# EAGLE design eg_for_wind (EAGLE 5.12)
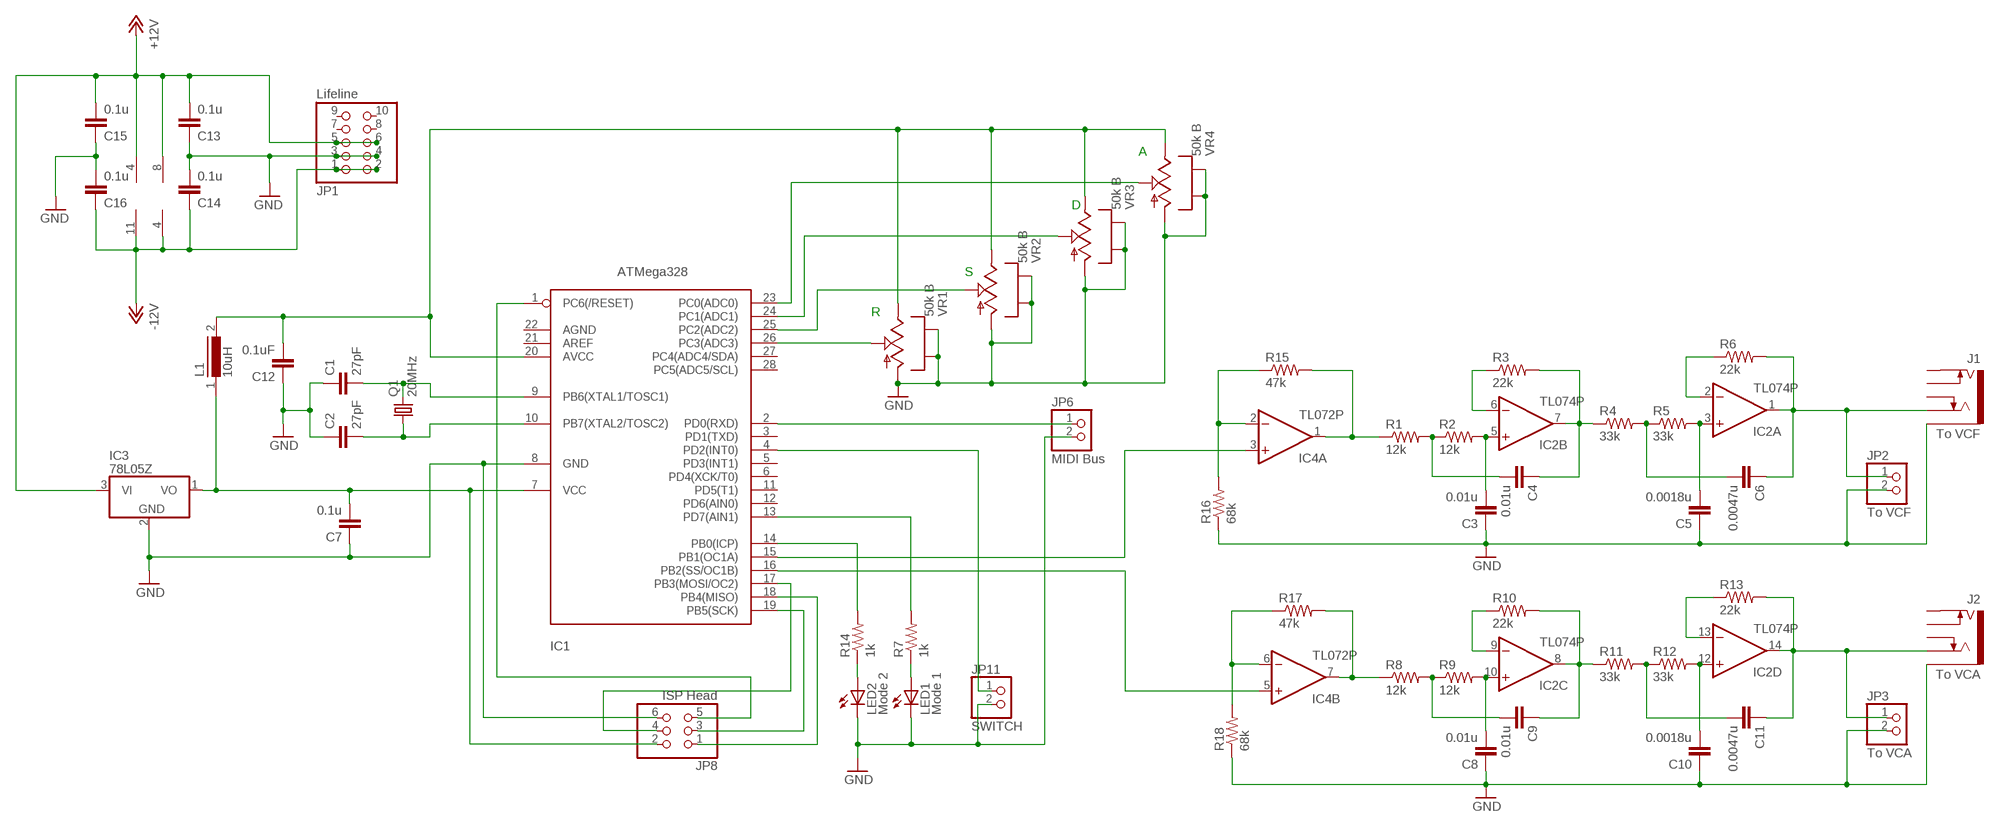
[diagram p0: schematic, sheet 1]

## Parts
C1  27pF  C-EU050-025X075  [C050-025X075]
C2  27pF  C-EU050-025X075  [C050-025X075]
C3  0.01u  C-EU050-025X075  [C050-025X075]
C4  0.01u  C-EU050-025X075  [C050-025X075]
C5  0.0018u  C-EU050-025X075  [C050-025X075]
C6  0.0047u  C-EU050-025X075  [C050-025X075]
C7  0.1u  C-EU050-025X075  [C050-025X075]
C8  0.01u  C-EU050-025X075  [C050-025X075]
C9  0.01u  C-EU050-025X075  [C050-025X075]
C10  0.0018u  C-EU050-025X075  [C050-025X075]
C11  0.0047u  C-EU050-025X075  [C050-025X075]
C12  0.1uF  C-EU050-025X075  [C050-025X075]
C13  0.1u  C-EU050-025X075  [C050-025X075]
C14  0.1u  C-EU050-025X075  [C050-025X075]
C15  0.1u  C-EU050-025X075  [C050-025X075]
C16  0.1u  C-EU050-025X075  [C050-025X075]
IC1  ATMega328  MEGA8-P  [DIL28-3]
IC2  TL074P  [DIL14]
IC3  78L05Z  [TO92]
IC4  TL072P  [DIL08]
J1  To VCF  MJ-352W-C"  [MJ-352-M-C]
J2  To VCA  MJ-352W-C"  [MJ-352-M-C]
JP1  Lifeline  PINHD-2X5  [2X05]
JP2  To VCF  PINHD-1X2  [1X02]
JP3  To VCA  PINHD-1X2  [1X02]
JP6  MIDI Bus  PINHD-1X2  [1X02]
JP8  ISP Head  PINHD-2X3  [2X03]
JP11  SWITCH  PINHD-1X2  [1X02]
L1  10uH  82114R  [82114R]
LED1  Mode 1  LED3MM  [LED3MM]
LED2  Mode 2  LED3MM  [LED3MM]
Q1  20MHz  CRYTALHC49S  [HC49/S]
R1  12k  R-US_0204/5_SF  [0204/5_SF]
R2  12k  R-US_0204/5_SF  [0204/5_SF]
R3  22k  R-US_0204/5_SF  [0204/5_SF]
R4  33k  R-US_0204/5_SF  [0204/5_SF]
R5  33k  R-US_0204/5_SF  [0204/5_SF]
R6  22k  R-US_0204/5_SF  [0204/5_SF]
R7  1k  R-US_0204/5_SF  [0204/5_SF]
R8  12k  R-US_0204/5_SF  [0204/5_SF]
R9  12k  R-US_0204/5_SF  [0204/5_SF]
R10  22k  R-US_0204/5_SF  [0204/5_SF]
R11  33k  R-US_0204/5_SF  [0204/5_SF]
R12  33k  R-US_0204/5_SF  [0204/5_SF]
R13  22k  R-US_0204/5_SF  [0204/5_SF]
R14  1k  R-US_0204/5_SF  [0204/5_SF]
R15  47k  R-US_0204/5_SF  [0204/5_SF]
R16  68k  R-US_0204/5_SF  [0204/5_SF]
R17  47k  R-US_0204/5_SF  [0204/5_SF]
R18  68k  R-US_0204/5_SF  [0204/5_SF]
VR1  50k B  POT-FRAMEE  [EVUE2]
VR2  50k B  POT-FRAMEE  [EVUE2]
VR3  50k B  POT-FRAMEE  [EVUE2]
VR4  50k B  POT-FRAMEE  [EVUE2]

## Nets
+12V: C13.2 C15.2 IC2.4(P:V+) IC3.3(VI) IC4.8(P:V+) JP1.5 JP1.6
-12V: C14.1 C16.1 IC2.11(P:V-) IC4.4(P:V-) JP1.1 JP1.2
GND: C1.1 C2.1 C3.1 C5.1 C7.1 C8.1 C10.1 C12.1 C13.1 C14.2 C15.1 C16.2 IC1.8(GND) IC3.2(GND) J1.P$1 J2.P$1 JP1.3 JP1.4 JP2.2 JP3.2 JP6.2 JP8.6 JP11.2 LED1.K(C) LED2.K(C) R16.1 R18.1 VR1.A VR1.FRAME1(KNOT1) VR1.FRAME2(KNOT2) VR2.A VR2.FRAME1(KNOT1) VR2.FRAME2(KNOT2) VR3.A VR3.FRAME1(KNOT1) VR3.FRAME2(KNOT2) VR4.A VR4.FRAME1(KNOT1) VR4.FRAME2(KNOT2)
N$1: C9.2 R8.2 R9.1
N$2: C4.2 R1.2 R2.1
N$3: C5.2 IC2.3(A:+IN) R5.2
N$4: C3.2 IC2.5(B:+IN) R2.2
N$5: C4.1 IC2.7(B:OUT) R3.2 R4.1
N$6: C6.2 R4.2 R5.1
N$7: C1.2 IC1.9(PB6(XTAL1/TOSC1)) Q1.2
N$8: C2.2 IC1.10(PB7(XTAL2/TOSC2)) Q1.1
N$9: IC1.23(PC0(ADC0)) VR4.S
N$10: IC1.24(PC1(ADC1)) VR3.S
N$11: IC1.25(PC2(ADC2)) VR2.S
N$12: IC1.26(PC3(ADC3)) VR1.S
N$13: LED2.A R14.1
N$14: IC2.6(B:-IN) R3.1
N$15: C10.2 IC2.12(D:+IN) R12.2
N$16: IC2.2(A:-IN) R6.1
N$17: C6.1 IC2.1(A:OUT) J1.P$2 JP2.1 R6.2
N$18: LED1.A R7.1
N$19: IC1.4(PD2(INT0)) JP11.1
N$20: IC1.2(PD0(RXD)) JP6.1
N$21: C8.2 IC2.10(C:+IN) R9.2
N$22: C9.1 IC2.8(C:OUT) R10.2 R11.1
N$23: C11.2 R11.2 R12.1
N$24: IC2.9(C:-IN) R10.1
N$25: IC2.13(D:-IN) R13.1
N$26: C11.1 IC2.14(D:OUT) J2.P$2 JP3.1 R13.2
N$27: IC1.15(PB1(OC1A)) IC4.3(A:+IN)
N$28: IC1.16(PB2(SS/OC1B)) IC4.5(B:+IN)
N$29: IC1.14(PB0(ICP)) R14.2
N$30: IC1.18(PB4(MISO)) JP8.1
N$31: C12.2 IC1.20(AVCC) L1.2 VR1.E VR2.E VR3.E VR4.E
N$32: IC1.19(PB5(SCK)) JP8.3
N$33: IC1.17(PB3(MOSI/OC2)) JP8.4
N$34: IC1.1(PC6(/RESET)) JP8.5
N$35: IC4.1(A:OUT) R1.1 R15.2
N$36: IC1.13(PD7(AIN1)) R7.2
N$38: IC4.7(B:OUT) R8.1 R17.2
N$39: IC4.2(A:-IN) R15.1 R16.2
N$40: IC4.6(B:-IN) R17.1 R18.2
N$41: C7.2 IC1.7(VCC) IC3.1(VO) JP8.2 L1.1
Unconnected: IC1.3(PD1(TXD)) IC1.5(PD3(INT1)) IC1.6(PD4(XCK/T0)) IC1.11(PD5(T1)) IC1.12(PD6(AIN0)) IC1.21(AREF) IC1.22(AGND) IC1.27(PC4(ADC4/SDA)) IC1.28(PC5(ADC5/SCL)) J1.P$3 J1.P$4 J1.P$5 J2.P$3 J2.P$4 J2.P$5 JP1.7 JP1.8 JP1.9 JP1.10

## Notes on the sheet
- A
- D
- S
- R

## Library data of the parts
C1-C16 = akihabara:C-EU: CAPACITOR, European symbol
IC1 = atmel:MEGA8-P: MICROCONTROLLER 8 Kbytes FLASH 1 kbytes SRAM 512 bytes EEPROM USART 4-channel 10 bit ADC 2-channel 8 bit ADC Source: avr.lbr
IC2 = linear:TL074: OP AMP
IC3 = linear:78*: Positive VOLTAGE REGULATOR Source: http://cache.national.com/ds/LM/LM78L05.pdf http://www.fairchildsemi.com/ds/LM/LM7805.pdf
IC4 = linear:TL072: OP AMP
J1 J2 = akihabara:MJ-352W-C: MJ-352W-C Marushin 3.5mm Stereo Jack
JP1 = pinhead:PINHD-2X5: PIN HEADER
JP2 JP3 JP6 JP11 = pinhead:PINHD-1X2: PIN HEADER
JP8 = pinhead:PINHD-2X3: PIN HEADER
L1 = inductors:82114R: INDUCTOR
LED1 LED2 = akihabara:LED: LED OSRAM: - CHIPLED LG R971, LG N971, LY N971, LG Q971, LY Q971, LO R971, LY R971 LH N974, LH R974 LS Q976, LO Q976, LY Q976 LO Q996 - Hyper CHIPLED LW Q18S LB Q993, LB Q99A, LB R99A - SideLED LS A670, LO A670, LY A670, LG A670, LP A670 LB A673, LV A673, LT A673, LW A673 LH A674 LY A675 LS A676, LA A676, LO A676, LY A676, LW A676 LS A679, LY A679, LG A679 - Hyper Micro SIDELED® LS Y876, LA Y876, LO Y876, LY Y876 LT Y87S - SmartLED LW L88C, LW L88S LB L89C, LB L89S, LG L890 LS L89K, LO L89K, LY L89K LS L896, LA L896, LO L896, LY L896 - TOPLED LS T670, LO T670, LY T670, LG T670, LP T670 LSG T670, LSP T670, LSY T670, LOP T670, LYG T670 LG T671, LOG T671, LSG T671 LB T673, LV T673, LT T673, LW T673 LH T674 LS T676, LA T676, LO T676, LY T676, LB T676, LH T676, LSB T676, LW T676 LB T67C, LV T67C, LT T67C, LS T67K, LO T67K, LY T67K, LW E67C LS E67B, LA E67B, LO E67B, LY E67B, LB E67C, LV E67C, LT E67C LW T67C LS T679, LY T679, LG T679 LS T770, LO T770, LY T770, LG T770, LP T770 LB T773, LV T773, LT T773, LW T773 LH T774 LS E675, LA E675, LY E675, LS T675 LS T776, LA T776, LO T776, LY T776, LB T776 LHGB T686 LT T68C, LB T68C - Hyper Mini TOPLED® LB M676 - Mini TOPLED Santana® LG M470 LS M47K, LO M47K, LY M47K Source: http://www.osram.convergy.de/
Q1 = crystal:CRYTAL: CRYSTAL
R1-R18 = akihabara:R-US_: RESISTOR, American symbol
VR1-VR4 = akihabara:POT-FRAME

## Board
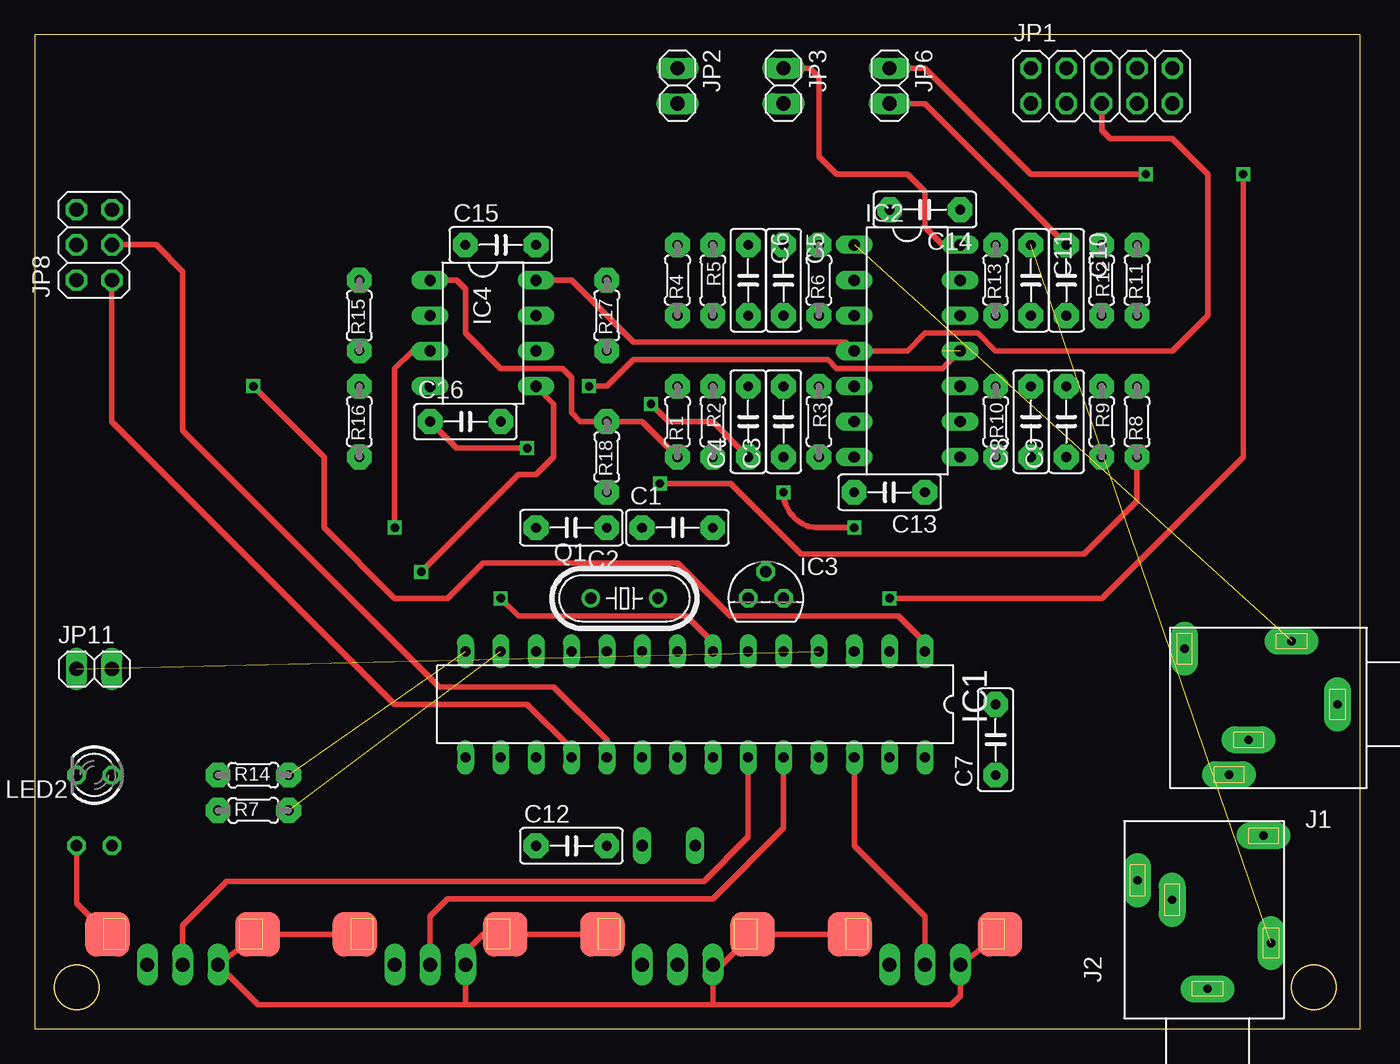
[diagram p1: board, top side]
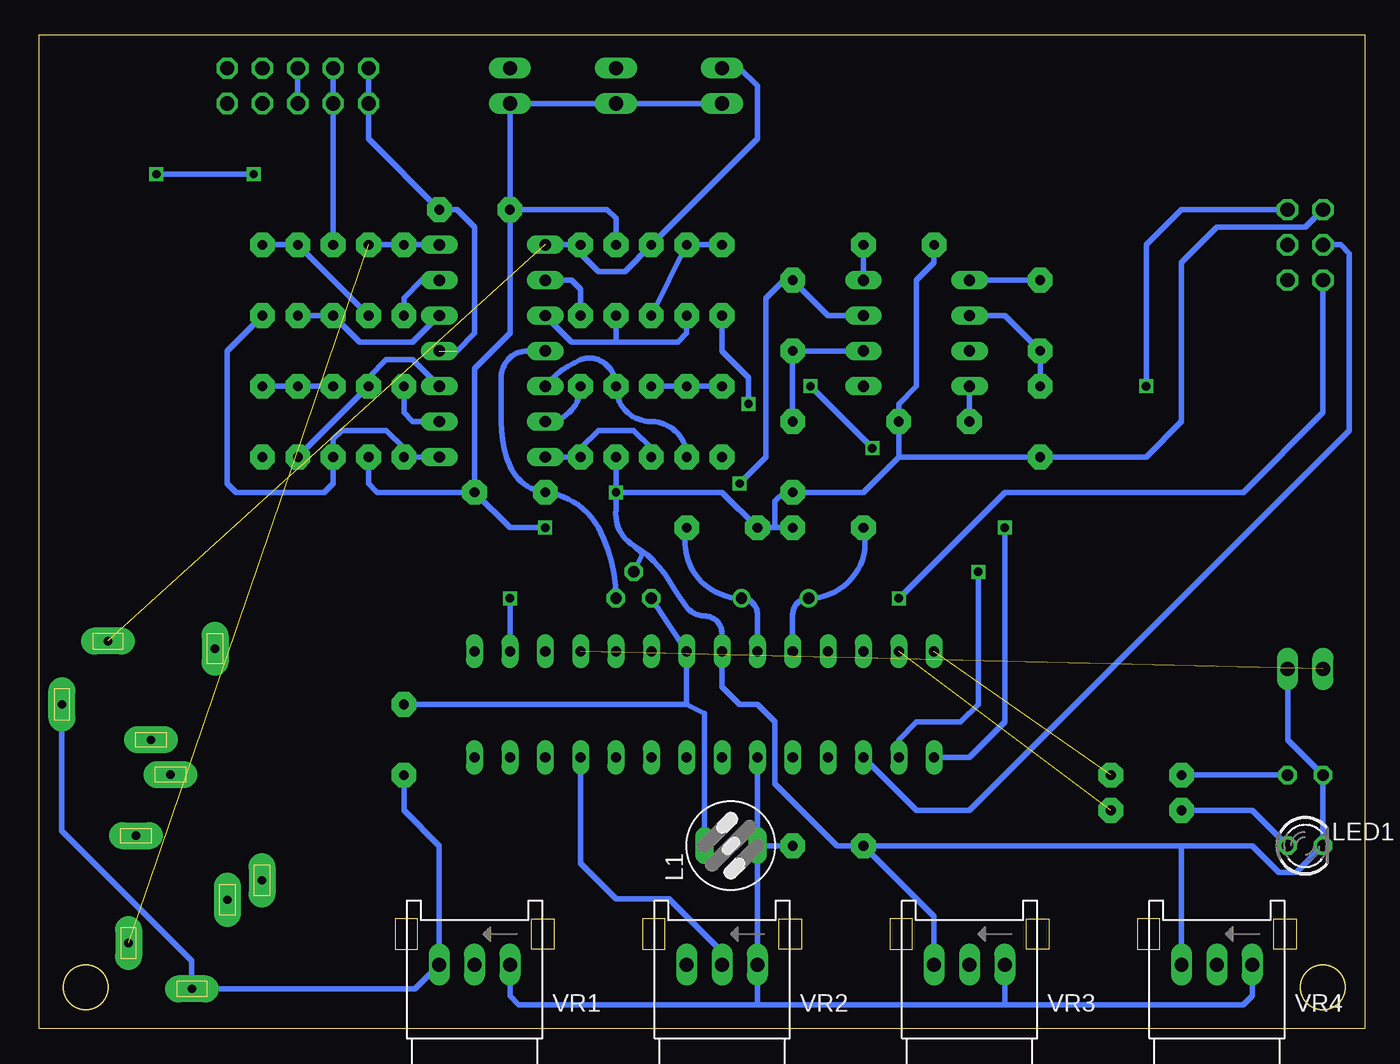
[diagram p2: board, bottom side, seen from below]

Size 95.25 x 71.44 mm. Coordinates in mm from the lower left corner, seen from the top.
Outline: 0,0 95.25,0 95.25,71.44 0,71.44 0,0
Outline: circle at 3,3 radius 1.6
Outline: circle at 91.9,3 radius 1.6
Copper layers (1*16): Top 0.035mm / dielectric 1.5mm / Bottom 0.035mm
Design rules "default": minimum track width 10mil, minimum drill 24mil, track to track 8mil, track to pad 8mil, pad to pad 8mil, via to via 8mil, smd to smd 8mil, copper to edge 40mil, drill to drill 8mil, minimum pad ring 10mil, minimum via ring 8mil, stop-mask expansion 4mil, vias tented up to drill 0mil, thermal gap 10mil

### Footprints (pad centres in the part's own frame; a part is rotated, then mirrored left to right if it is on the bottom)
C050-025X075 = drill 0.7 pad 1.778 octagon: 1 -2.54,0; 2 2.54,0
DIL28-3 = drill 0.726 long: 1 -16.51,-3.81; 2 -13.97,-3.81; 3 -11.43,-3.81; 4 -8.89,-3.81; 5 -6.35,-3.81; 6 -3.81,-3.81; 7 -1.27,-3.81; 8 1.27,-3.81; 9 3.81,-3.81; 10 6.35,-3.81; 11 8.89,-3.81; 12 11.43,-3.81; 13 13.97,-3.81; 14 16.51,-3.81; 15 16.51,3.81; 16 13.97,3.81; 17 11.43,3.81; 18 8.89,3.81; 19 6.35,3.81; 20 3.81,3.81; 21 1.27,3.81; 22 -1.27,3.81; 23 -3.81,3.81; 24 -6.35,3.81; 25 -8.89,3.81; 26 -11.43,3.81; 27 -13.97,3.81; 28 -16.51,3.81
DIL14 = drill 0.813 long: 1 -7.62,-3.81; 2 -5.08,-3.81; 3 -2.54,-3.81; 4 0,-3.81; 5 2.54,-3.81; 6 5.08,-3.81; 7 7.62,-3.81; 8 7.62,3.81; 9 5.08,3.81; 10 2.54,3.81; 11 0,3.81; 12 -2.54,3.81; 13 -5.08,3.81; 14 -7.62,3.81
TO92 = drill 0.813 octagon: 1 -1.27,0; 2 0,1.905; 3 1.27,0
DIL08 = drill 0.813 long: 1 -3.81,-3.81; 2 -1.27,-3.81; 3 1.27,-3.81; 4 3.81,-3.81; 5 3.81,3.81; 6 1.27,3.81; 7 -1.27,3.81; 8 -3.81,3.81
MJ-352-M-C = drill 0.6 pad 1.95 long: P$1 2.1,0; P$2 5.4,-4.55; P$3 13.1,-4; P$4 8.5,2.55; P$5 9.9,5.05
2X05 = drill 1.016 octagon: 1 -5.08,-1.27; 2 -5.08,1.27; 3 -2.54,-1.27; 4 -2.54,1.27; 5 0,-1.27; 6 0,1.27; 7 2.54,-1.27; 8 2.54,1.27; 9 5.08,-1.27; 10 5.08,1.27
1X02 = drill 1.016 long: 1 -1.27,0; 2 1.27,0
2X03 = drill 1.016 octagon: 1 -2.54,-1.27; 2 -2.54,1.27; 3 0,-1.27; 4 0,1.27; 5 2.54,-1.27; 6 2.54,1.27
82114R = drill 0.813 long: 1 0,1.905; 2 0,-1.905
LED3MM = drill 0.813 octagon: A -1.27,0; K 1.27,0
HC49/S = drill 0.813 round: 1 -2.413,0; 2 2.413,0
0204/5_SF = drill 0.7 pad 1.778 octagon: 1 -2.54,0; 2 2.54,0
EVUE2 = drill 1 long: A 2.54,2.2; E -2.54,2.2; S 0,2.2 | smd 3.175 x 3.2 bottom: FRAME1 -5.397,0; FRAME2 5.397,0

### Placement (x,y rotation side)
C1  46.18,36.02 0 top
C2  38.56,36.02 180 top
C3  53.8,43.64 90 top
C4  51.26,43.64 90 top
C5  53.8,53.8 270 top
C6  51.26,53.8 270 top
C7  69.04,20.78 90 top
C8  71.58,43.64 90 top
C9  74.12,43.64 90 top
C10  74.12,53.8 270 top
C11  71.58,53.8 270 top
C12  38.56,13.16 0 top
C13  61.42,38.56 180 top
C14  63.96,58.88 180 top
C15  33.48,56.34 0 top
C16  30.94,43.64 0 top
IC1  47.45,23.32 180 top
IC2  62.69,48.72 270 top
IC3  52.53,30.94 0 top
IC4  32.21,49.99 270 top
J1  95.71,23.32 180 top
J2  84.28,0.78 90 top
JP1  76.66,67.77 0 top
JP2  46.18,67.77 270 top
JP3  53.8,67.77 270 top
JP6  61.42,67.77 270 top
JP8  4.27,56.34 90 top
JP11  4.27,25.86 0 top
L1  45.55,13.16 90 bottom
LED1  4.27,13.16 0 bottom
LED2  4.27,18.24 180 top
Q1  42.37,30.94 0 top
R1  46.18,43.64 90 top
R2  48.72,43.64 270 top
R3  56.34,43.64 270 top
R4  46.18,53.8 90 top
R5  48.72,53.8 270 top
R6  56.34,53.8 90 top
R7  15.7,15.7 0 top
R8  79.2,43.64 90 top
R9  76.66,43.64 270 top
R10  69.04,43.64 270 top
R11  79.2,53.8 90 top
R12  76.66,53.8 270 top
R13  69.04,53.8 90 top
R14  15.7,18.24 0 top
R15  23.32,51.26 90 top
R16  23.32,43.64 90 top
R17  41.1,51.26 90 top
R18  41.1,41.1 90 top
VR1  63.96,6.81 180 bottom
VR2  46.18,6.81 180 bottom
VR3  28.4,6.81 180 bottom
VR4  10.62,6.81 180 bottom

### Tracks (layer width: path | path; a pad name or v marks a point on that pad's centre or on a via)
+12V
  Top 0.406: IC4.8 38.56,53.8 43.01,49.36 58.24,49.36 IC2.4 62.69,48.72 63.96,49.99 67.77,49.99 69.04,48.72 81.74,48.72 84.28,51.26 84.28,61.42 81.74,63.96 77.29,63.96 76.66,64.59 JP1.5
  Bottom 0.406: IC2.4 60.15,48.72 arc-90 62.05,46.81 62.05,43.64 arc-23 61.42,40.47 arc-61 C13.2 arc55 55.07,36.02 arc30 IC3.3 | IC4.8 C15.2 | JP1.5 JP1.6
-12V  (via drill 0.6)  (1 unrouted)
  Top 0.406: IC2.11 65.23,47.45 57.61,47.45 56.98,48.09 43.01,48.09 41.1,46.18 v39.83,46.18 | v35.38,41.73 30.3,41.73 C16.1
  Bottom 0.406: 65.23,48.72 63.96,49.99 63.96,57.61 65.23,58.88 C14.1 71.58,63.96 JP1.1 JP1.2 | C16.1 IC4.4 | v35.38,41.73 v39.83,46.18
GND  (via drill 0.6)
  Top 0.406: v58.88,36.02 56.34,36.02 arc-90 v53.8,38.56 | 5.54,6.81 VR4.FRAME1 3,9.03 LED1.K | VR3.FRAME1 VR4.FRAME2 VR4.A 16.04,1.73 30.94,1.73 | VR2.FRAME1 VR3.FRAME2 33.14,6.81 32.68,6.34 32.21,6.81 30.94,5.54 VR3.A 30.94,1.73 | VR1.FRAME2 VR1.A 66.5,2.37 65.86,1.73 48.72,1.73 | VR1.FRAME1 VR2.FRAME2 49.38,4.61 VR2.A 48.72,1.73 | 30.94,1.73 48.72,1.73 | JP6.2 63.96,66.5 C10.1
  Bottom 0.406: 42.37,36.02 C2.1 | 42.37,36.02 C1.1 46.18,38.56 v53.8,38.56 | C12.1 37.93,13.16 42.37,17.61 42.37,22.05 43.64,23.32 44.91,23.32 46.18,24.59 IC1.8 46.18,28.4 arc-90 47.45,29.67 arc53 48.72,30.3 arc6 49.99,32.21 arc-29 52.53,34.75 | C12.1 30.94,8.08 VR3.A | 52.53,34.75 arc66 53.8,37.29 v53.8,38.56 | v53.8,38.56 C3.1 | IC3.2 51.9,34.12 52.53,34.75 | 33.48,41.1 R16.1 15.7,41.1 13.16,43.64 13.16,55.07 10.62,57.61 4.27,57.61 JP8.6 | 42.37,36.02 42.37,37.93 41.73,38.56 R18.1 36.02,38.56 33.48,41.1 | 33.48,41.1 C16.2 33.48,44.91 32.21,46.18 32.21,53.8 30.94,55.07 C15.1 | C13.1 63.96,47.45 61.42,49.99 C14.2 | C13.1 70.94,38.56 71.58,39.2 C8.1 | JP2.2 JP3.2 JP6.2 C14.2 | C13.1 61.42,36.02 v58.88,36.02 | C5.1 53.8,58.24 54.44,58.88 C14.2 | 13.16,13.16 VR4.A | 13.16,13.16 C12.1 | C7.1 69.04,15.7 66.5,13.16 VR1.A 68.23,2.88 J2.P$1 84.28,4.91 93.61,14.24 J1.P$1 | JP11.2 5.54,20.78 LED2.K LED1.K 4.91,11.26 6.17,11.26 8.08,13.16 13.16,13.16 | C10.1 JP1.3 JP1.4
N$1
  Bottom 0.406: R8.2 R9.1 C9.2
N$2
  Bottom 0.406: R1.2 R2.1 C4.2
N$3
  Bottom 0.406: IC2.3 56.98,49.36 53.8,49.36 | 53.8,49.36 49.36,49.36 48.72,49.99 R5.2 | 53.8,49.36 C5.2
N$4
  Bottom 0.406: R2.2 arc-90 51.26,43.64 arc90 C3.2 arc-67 55.07,48.09 arc-45 56.34,48.09 arc-28 IC2.5
N$5  (via drill 0.6)
  Top 0.406: C4.1 48.72,43.64 45.55,43.64 v44.27,44.91
  Bottom 0.406: IC2.7 R3.2 56.34,41.73 55.07,43.01 52.53,43.01 51.26,41.73 C4.1 | R4.1 46.18,48.72 44.27,46.81 v44.27,44.91
N$6
  Bottom 0.406: R4.2 R5.1 C6.2
N$7
  Bottom 0.406: IC1.9 43.64,29.8 arc-90 Q1.2 arc104 C1.2
N$8
  Bottom 0.406: IC1.10 41.1,29.8 arc90 Q1.1 arc-104 C2.2
N$9
  Top 0.406: VR4.S 10.62,7.45 13.8,10.62 48.09,10.62 51.26,13.8 IC1.23
N$10
  Top 0.406: VR3.S 28.4,8.08 29.67,9.35 48.72,9.35 53.8,14.43 IC1.24
N$11
  Bottom 0.406: VR2.S 46.18,5.54 49.99,9.35 53.8,9.35 56.34,11.89 IC1.25
N$12
  Top 0.406: VR1.S 63.96,8.08 58.88,13.16 IC1.26
N$13
  Bottom 0.406: LED2.A R14.1
N$14
  Bottom 0.406: IC2.6 arc-90 R3.1
N$15
  Bottom 0.406: R12.2 C10.2 72.21,49.36 68.4,49.36 IC2.12
N$16
  Bottom 0.406: R6.1 56.34,53.16 56.98,53.8 IC2.2
N$17  (1 unrouted)
  Bottom 0.406: IC2.1 R6.2 56.34,55.7 55.07,54.44 53.16,54.44 C6.1 43.64,63.96 43.64,67.77 44.91,69.04 JP2.1
N$18
  Bottom 0.406: LED1.A 8.08,15.7 R7.1
N$19  (1 unrouted)
N$20  (via drill 0.6)
  Top 0.406: v61.42,30.94 76.66,30.94 86.82,41.1 v86.82,61.42 | v79.83,61.42 71.58,61.42 63.96,69.04 JP6.1
  Bottom 0.406: IC1.2 v61.42,30.94 | v86.82,61.42 v79.83,61.42
N$21
  Bottom 0.406: IC2.10 68.4,48.09 70.31,48.09 71.58,46.81 C8.2 R9.2
N$22
  Bottom 0.406: IC2.8 R10.2 69.04,41.73 70.31,43.01 73.48,43.01 74.12,42.37 C9.1 74.12,39.2 74.75,38.56 81.1,38.56 81.74,39.2 81.74,48.72 R11.1
N$23
  Bottom 0.406: R11.2 R12.1 C11.2
N$24
  Bottom 0.406: IC2.9 68.4,43.64 69.04,44.27 R10.1
N$25
  Bottom 0.406: IC2.13 67.77,53.8 69.04,52.53 R13.1
N$26  (1 unrouted)
  Top 0.406: JP3.1 55.7,69.04 56.34,68.4 56.34,62.69 57.61,61.42 62.69,61.42 63.96,60.15 63.96,57.61 65.23,56.34 IC2.14
  Bottom 0.406: IC2.14 R13.2 C11.1
N$27  (via drill 0.6)
  Top 0.406: IC4.3 27.13,48.72 25.86,47.45 v25.86,36.02
  Bottom 0.406: IC1.15 28.4,19.51 25.86,22.05 v25.86,36.02
N$28  (via drill 0.6)
  Top 0.406: v27.77,32.84 34.75,39.83 36.02,39.83 37.29,41.1 37.29,44.91 IC4.5
  Bottom 0.406: v27.77,32.84 27.77,23.32 29.04,22.05 32.21,22.05 33.48,20.78 IC1.16
N$29  (1 unrouted)
N$30
  Top 0.406: IC1.18 38.56,20.14 35.38,23.32 25.86,23.32 5.54,43.64 JP8.1
N$31
  Bottom 0.406: L1.2 IC1.20 | L1.2 C12.2 | 43.64,1.73 60.79,1.73 61.42,2.37 VR1.E | 43.64,1.73 VR2.E L1.2 | VR4.E 8.08,2.37 8.72,1.73 25.86,1.73 | 25.86,1.73 43.64,1.73 | 25.86,1.73 VR3.E
N$32
  Top 0.406: IC1.19 41.1,20.78 37.29,24.59 29.04,24.59 10.62,43.01 10.62,54.44 8.72,56.34 JP8.3
N$33
  Bottom 0.406: IC1.17 32.21,15.7 28.4,15.7 1.09,43.01 1.09,55.7 1.73,56.34 JP8.4
N$34  (via drill 0.6)
  Top 0.406: v15.7,46.18 20.78,41.1 20.78,36.02 25.86,30.94 29.67,30.94 32.21,33.48 46.18,33.48 49.99,29.67 62.05,29.67 63.96,27.77 IC1.1
  Bottom 0.406: JP8.5 13.16,58.88 15.7,56.34 v15.7,46.18
N$35
  Top 0.406: IC4.1 30.3,53.8 30.94,53.16 30.94,49.99 33.48,47.45 37.93,47.45 38.56,46.81 38.56,44.27 39.2,43.64 40.47,43.64 41.1,43.64 43.64,43.64 R1.1
  Bottom 0.406: R15.2 IC4.1
N$36  (1 unrouted)
N$38  (via drill 0.6)
  Top 0.406: v44.91,39.2 49.99,39.2 55.07,34.12 75.39,34.12 79.2,37.93 R8.1
  Bottom 0.406: IC4.7 38.56,51.26 R17.2 41.73,53.8 43.01,52.53 43.01,41.1 v44.91,39.2
N$39
  Bottom 0.406: R16.2 R15.1 25.86,51.26 IC4.2
N$40
  Bottom 0.406: IC4.6 R17.1 R18.2
N$41  (via drill 0.6)
  Top 0.406: v33.48,30.94 34.75,29.67 46.81,29.67 48.72,27.77 IC1.7
  Bottom 0.406: L1.1 47.45,22.69 48.72,23.32 | 48.72,23.32 C7.2 | 48.72,23.32 IC1.7 IC3.1 | JP8.2 3,44.27 8.72,38.56 25.86,38.56 v33.48,30.94